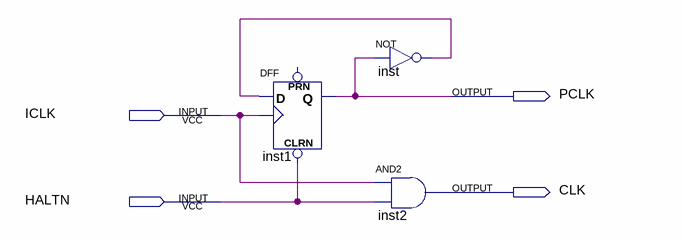
[diagram p0: schematic sheet]
// Quartus schematic CLK_GEN.bdf as structural Verilog: 3 symbols, 4 pins
module CLK_GEN (
  input  ICLK,
  input  HALTN,
  output PCLK,
  output CLK
);

  wire inst_out;

  DFF inst1 (.CLRN(HALTN), .CLK(ICLK), .D(inst_out), .Q(PCLK));  // open: PRN
  not inst (inst_out, PCLK);
  and inst2 (CLK, ICLK, HALTN);
endmodule
